# Altium schematic sheet Mach trai tim.SchDoc: Bài 1: Mạch trái tim
size A4; DrawnBy: Lai Phuoc Son; Revision: V1-1; SheetNumber: 1; SheetTotal: 1; ModifiedDate: 2014-06-07
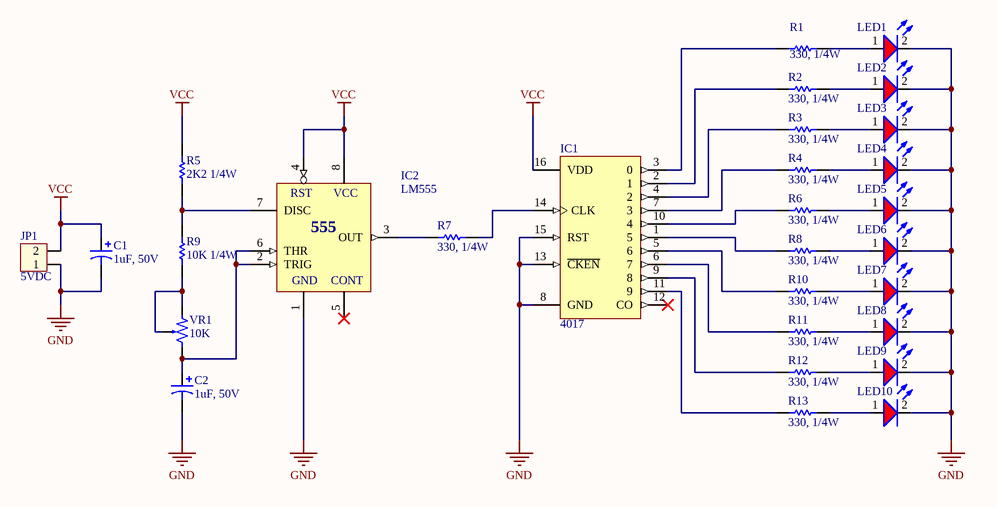
[diagram p0: Mach trai tim.SchDoc]

## Parts
C1  value 1uF, 50V  [CAP_1UF_50V]  (hidden comment: GSR10M016-0511TAF)
C2  value 1uF, 50V  [CAP_1UF_50V]  (hidden comment: GSR10M016-0511TAF)
IC1  4017  [74HC4017]
IC2  LM555  [LM555]
JP1  5VDC  [CON2]
LED1  LED_R_5  [LED5R]  (value not drawn)
LED2  LED_R_5  [LED5R]  (value not drawn)
LED3  LED_R_5  [LED5R]  (value not drawn)
LED4  LED_R_5  [LED5R]  (value not drawn)
LED5  LED_R_5  [LED5R]  (value not drawn)
LED6  LED_R_5  [LED5R]  (value not drawn)
LED7  LED_R_5  [LED5R]  (value not drawn)
LED8  LED_R_5  [LED5R]  (value not drawn)
LED9  LED_R_5  [LED5R]  (value not drawn)
LED10  LED_R_5  [LED5R]  (value not drawn)
R1  value 330, 1/4W  [RES 1/4W CFR25]  (hidden comment: CF1/4W1KJ25)
R2  value 330, 1/4W  [RES 1/4W CFR25]  (hidden comment: CF1/4W1KJ25)
R3  value 330, 1/4W  [RES 1/4W CFR25]  (hidden comment: CF1/4W1KJ25)
R4  value 330, 1/4W  [RES 1/4W CFR25]  (hidden comment: CF1/4W1KJ25)
R5  value 2K2 1/4W  [RES 1/4W CFR25]  (hidden comment: CF1/4W1KJ25)
R6  value 330, 1/4W  [RES 1/4W CFR25]  (hidden comment: CF1/4W1KJ25)
R7  value 330, 1/4W  [RES 1/4W CFR25]  (hidden comment: CF1/4W1KJ25)
R8  value 330, 1/4W  [RES 1/4W CFR25]  (hidden comment: CF1/4W1KJ25)
R9  value 10K 1/4W  [RES 1/4W CFR25]  (hidden comment: CF1/4W1KJ25)
R10  value 330, 1/4W  [RES 1/4W CFR25]  (hidden comment: CF1/4W1KJ25)
R11  value 330, 1/4W  [RES 1/4W CFR25]  (hidden comment: CF1/4W1KJ25)
R12  value 330, 1/4W  [RES 1/4W CFR25]  (hidden comment: CF1/4W1KJ25)
R13  value 330, 1/4W  [RES 1/4W CFR25]  (hidden comment: CF1/4W1KJ25)
VR1  10K  [VR1]

## Nets
GND: C1.2 C2.2 IC1.8(GND) IC1.13(~{CKEN}) IC1.15(RST) IC2.1(GND) JP1.1 LED1.2(K) LED2.2(K) LED3.2(K) LED4.2(K) LED5.2(K) LED6.2(K) LED7.2(K) LED8.2(K) LED9.2(K) LED10.2(K)
VCC: C1.1 IC1.16(VDD) IC2.4(RST) IC2.8(VCC) JP1.2 R5.2
NetC2_1: C2.1 IC2.2(TRIG) IC2.6(THR) VR1.3
NetIC1_1: IC1.1(5) R8.1
NetIC1_2: IC1.2(1) R2.1
NetIC1_3: IC1.3(0) R1.1
NetIC1_4: IC1.4(2) R3.1
NetIC1_5: IC1.5(6) R10.1
NetIC1_6: IC1.6(7) R11.1
NetIC1_7: IC1.7(3) R4.1
NetIC1_9: IC1.9(8) R12.1
NetIC1_10: IC1.10(4) R6.1
NetIC1_11: IC1.11(9) R13.1
NetIC1_14: IC1.14(CLK) R7.2
NetIC2_3: IC2.3(OUT) R7.1
NetIC2_7: IC2.7(DISC) R5.1 R9.2
NetLED1_1: LED1.1(A) R1.2
NetLED2_1: LED2.1(A) R2.2
NetLED3_1: LED3.1(A) R3.2
NetLED4_1: LED4.1(A) R4.2
NetLED5_1: LED5.1(A) R6.2
NetLED6_1: LED6.1(A) R8.2
NetLED7_1: LED7.1(A) R10.2
NetLED8_1: LED8.1(A) R11.2
NetLED9_1: LED9.1(A) R12.2
NetLED10_1: LED10.1(A) R13.2
NetR9_1: R9.1 VR1.1 VR1.2

Not connected (* = marked no-connect by the designer): IC1 12(CO)*; IC2 5(CONT)*

## Notes on the sheet
- Title
- Size:
- Date:
- A4
- Number:
- Time:
- Revision:
- Sheet
- of
- LẠI PHƯỚC SƠN
- elec2pcb@gmail.com
- elec2pcb.com
- File:
- (in symbol LM555) 555

## Library data of the parts
C1 C2 = GSR10M016-0511TAF: CAP GSR 0511 10uF 16V 20%; ComponentLink1Description: Datasheet; ComponentLink1URL: D:\Dropbox\Datasheets\Passive Components\Capacitors\GSR Aluminum electrolytic capacitors.pdf
IC1 = 4017: Decade Counter/Divider with 10 Decoded Outputs; Designed by: VanDungEvn; Value: CD4017
IC2 = LM555: Timer; Value: LM555
JP1 = Con2: Connector 2; Value: Connector 2
LED1-LED10 = LED_RED_5MM: LED Red 5mm; ComponentLink1Description: Datasheet; ComponentLink1URL: D:\Dropbox\Datasheets\Opto and Illumination\LEDs\SMD LED.pdf; Unit Price: 0.0476
R1-R13 = CF1/4W1KJ25: RES CF AXIAL-0.3 5% 1/4W 1K; Unit Price: 0.001; ComponentLink1Description: Datasheet; ComponentLink1URL: D:\Dropbox\Datasheets\Passive Components\Resistors\Carbon Film Resistor.pdf
VR1 = VR2: Var Resistor; Value: VR 10K